# EasyEDA schematic SCH_ENAK-display_2025-10-05.json
TITLE: Display/bargraph module; REV: 1.0; Date: 2025-07-05; Sheet: 1/1; Drawn By: Jakub Pelc; Company: swpelc.eu
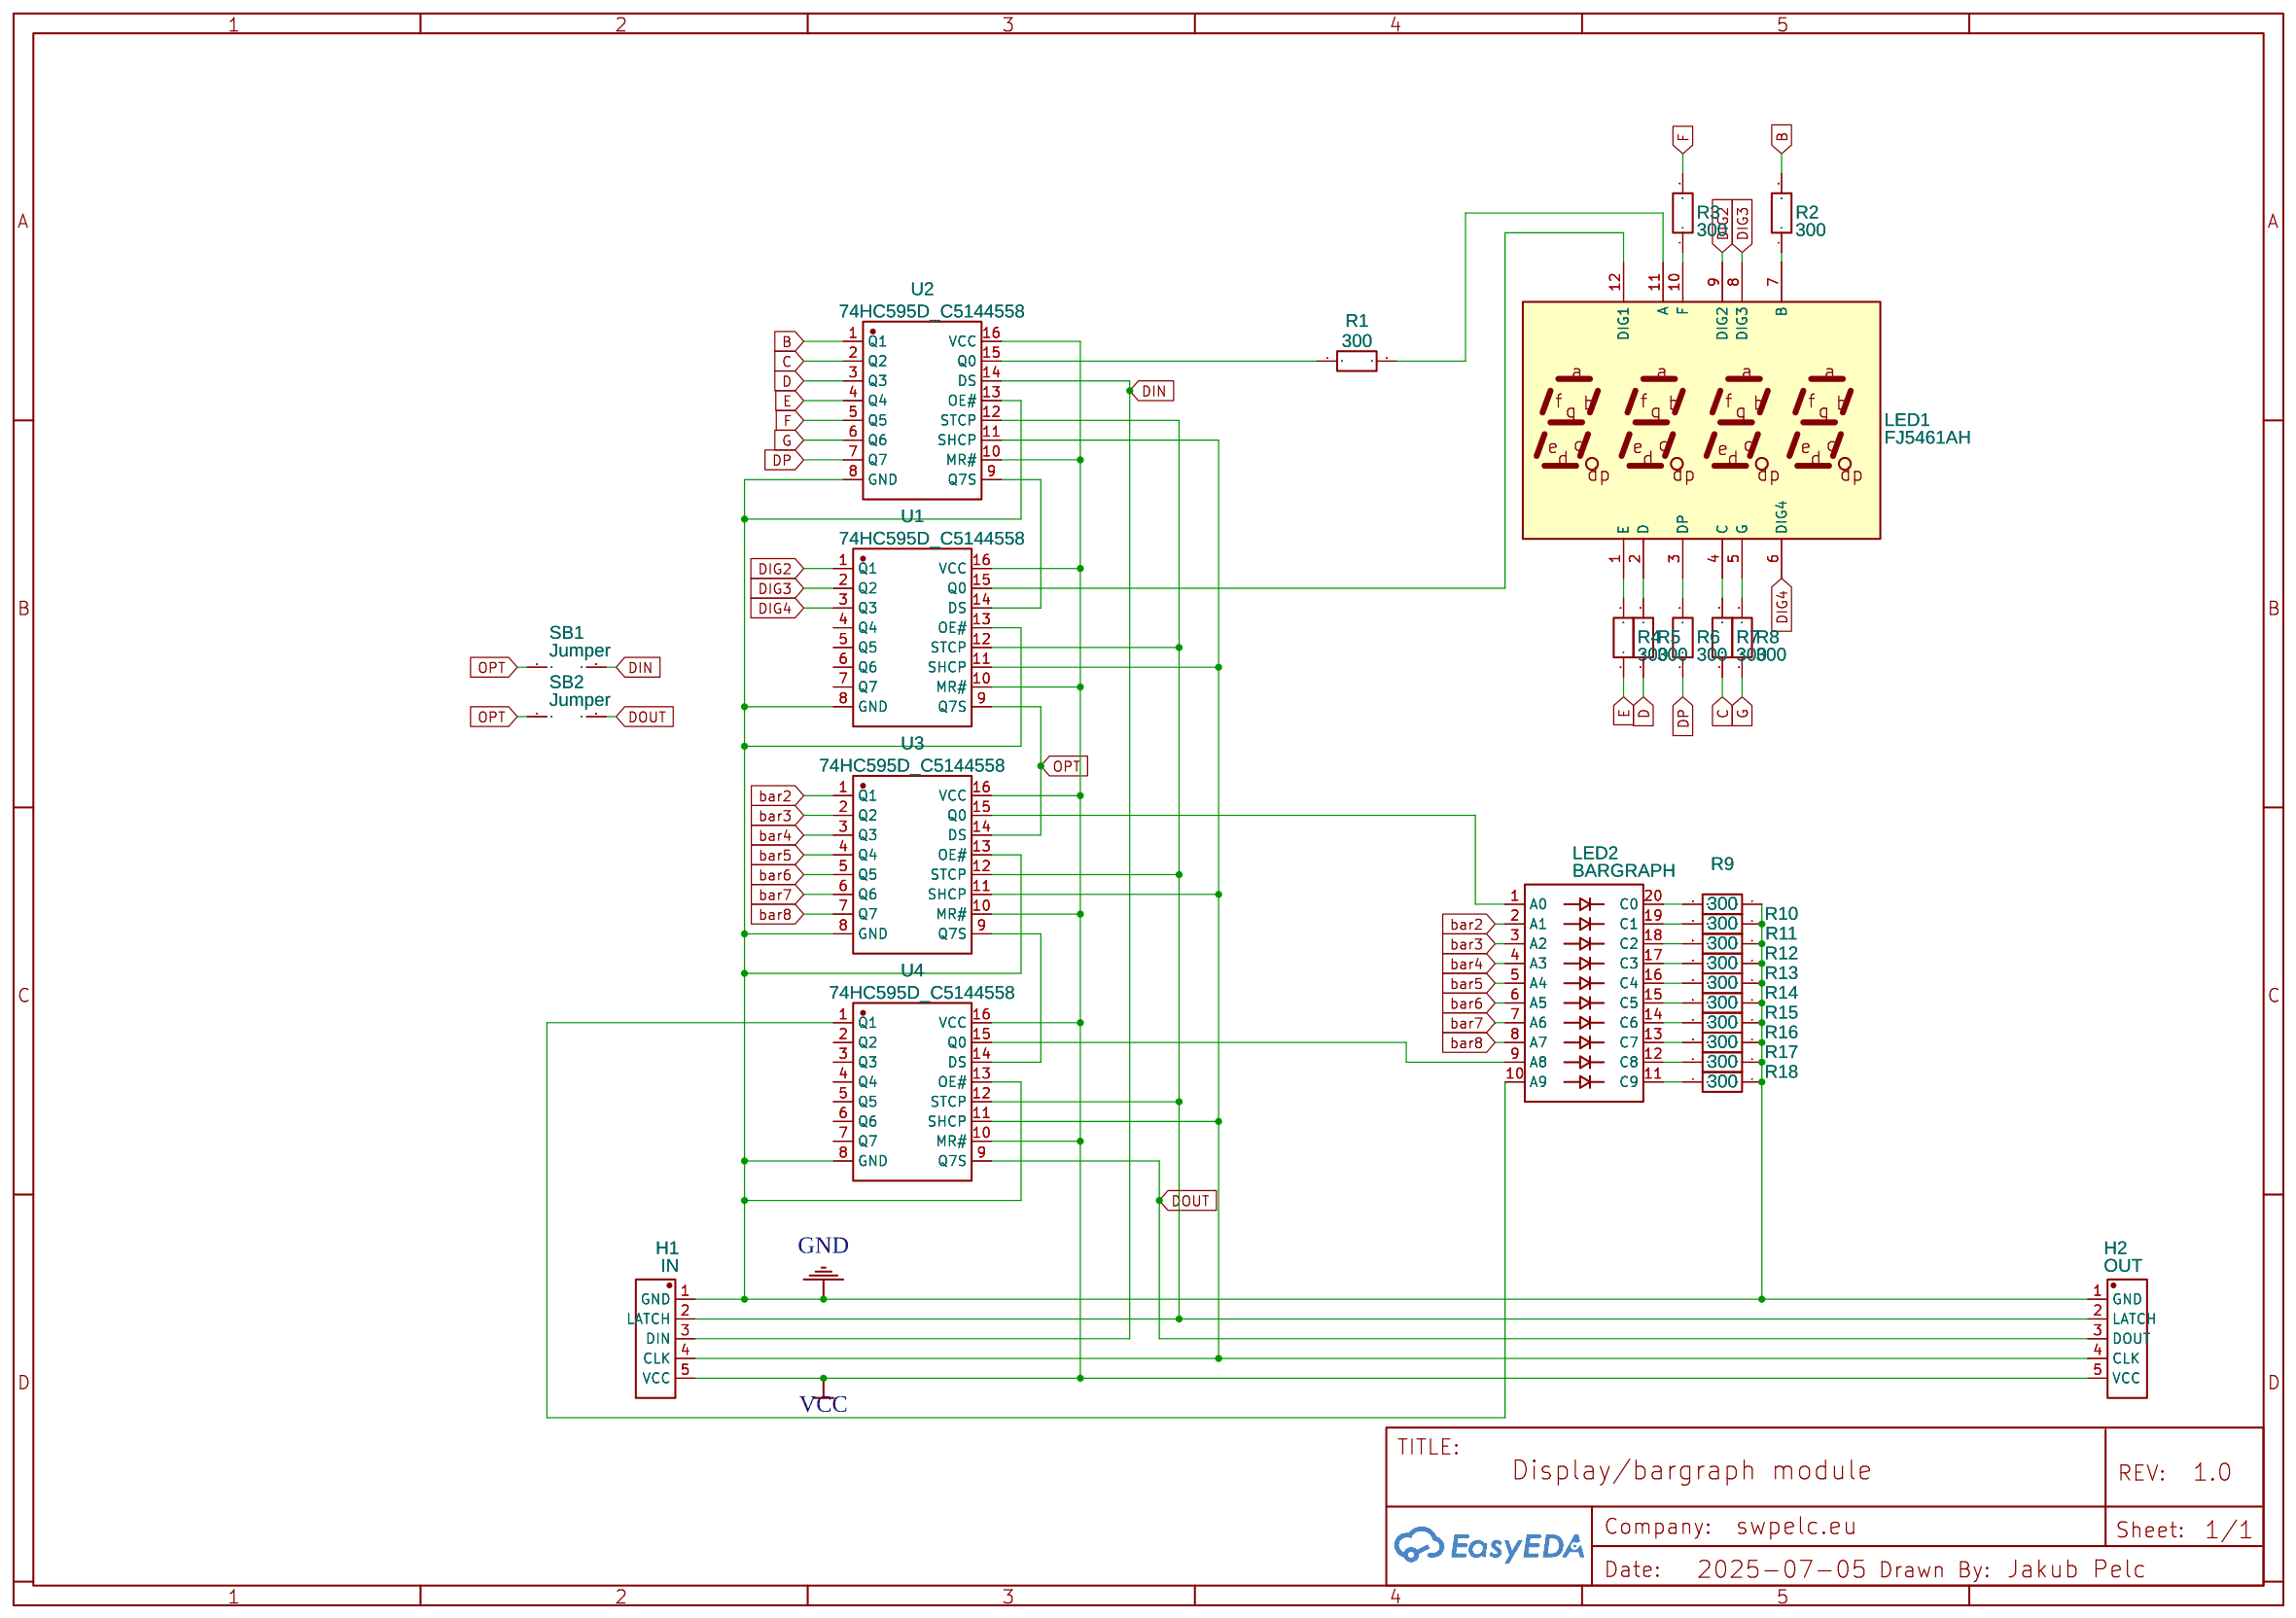
[diagram p0: schematic sheet]

## Parts
H1  IN  [HEADER-HEADER-FEMALE-2.54_1X5]
H2  OUT  [HEADER-HEADER-FEMALE-2.54_1X5]
LED1  FJ5461AH  [LED-SEG-TH_12P-L50.3-W19.0-P2.54-S15.24-BL]
LED2  BARGRAPH  [BARGRAPH]
R1  300  [R0603]
R2  300  [R0603]
R3  300  [R0603]
R4  300  [R0603]
R5  300  [R0603]
R6  300  [R0603]
R7  300  [R0603]
R8  300  [R0603]
R9  300  [R0603]
R10  300  [R0603]
R11  300  [R0603]
R12  300  [R0603]
R13  300  [R0603]
R14  300  [R0603]
R15  300  [R0603]
R16  300  [R0603]
R17  300  [R0603]
R18  300  [R0603]
SB1  Jumper  [PAD-JUMPER-2-OPEN-0603]
SB2  Jumper  [PAD-JUMPER-2-OPEN-0603]
U1  74HC595D_C5144558  [SOIC-16_L9.9-W3.9-P1.27-LS6.0-BL]
U2  74HC595D_C5144558  [SOIC-16_L9.9-W3.9-P1.27-LS6.0-BL]
U3  74HC595D_C5144558  [SOIC-16_L9.9-W3.9-P1.27-LS6.0-BL]
U4  74HC595D_C5144558  [SOIC-16_L9.9-W3.9-P1.27-LS6.0-BL]

## Library data of the parts
H1 H2 = HEADER - 2.54_1X5: Contributor: sohail.hdesign
LED1 = FJ5461AH: Supplier: LCSC; Manufacturer: 志浩; Manufacturer Part: FJ5461AH 橙红; Supplier Part: C10709; JLCPCB Part Class: Extended Part
LED2 = BARGRAPH: Contributor: mantex
R1-R18 = R_0603_EU: Supplier Part: C2907148; Supplier: LCSC; Contributor: LCEDA_Lib
SB1 SB2 = SMD JUMPER OPEN 2 PIN: Supplier: LCSC; Supplier Part: C21189; Manufacturer: NONE; Manufacturer Part: 0603WAF0000T5E; Contributor: Mirco Gaggiottini
U1-U4 = 74HC595D_C5144558: Supplier: LCSC; Supplier Part: C5144558; Manufacturer: JSMSEMI(杰盛微); Manufacturer Part: 74HC595D; JLCPCB Part Class: Extended Part; Contributor: lcsc

## Nets
GND: H1.1(GND) H2.1(GND) R9.1 R10.1 R11.1 R12.1 R13.1 R14.1 R15.1 R16.1 R17.1 R18.1 U1.8(GND) U1.13(OE#) U2.8(GND) U2.13(OE#) U3.8(GND) U3.13(OE#) U4.8(GND) U4.13(OE#)
VCC: H1.5(VCC) H2.5(VCC) U1.10(MR#) U1.16(VCC) U2.10(MR#) U2.16(VCC) U3.10(MR#) U3.16(VCC) U4.10(MR#) U4.16(VCC)
B: R2.2 U2.1(Q1)
bar2: LED2.2(A1) U3.1(Q1)
bar3: LED2.3(A2) U3.2(Q2)
bar4: LED2.4(A3) U3.3(Q3)
bar5: LED2.5(A4) U3.4(Q4)
bar6: LED2.6(A5) U3.5(Q5)
bar7: LED2.7(A6) U3.6(Q6)
bar8: LED2.8(A7) U3.7(Q7)
C: R7.1 U2.2(Q2)
D: R5.1 U2.3(Q3)
DIG2: LED1.9(DIG2) U1.1(Q1)
DIG3: LED1.8(DIG3) U1.2(Q2)
DIG4: LED1.6(DIG4) U1.3(Q3)
DIN: H1.3(DIN) SB1.2(N) U2.14(DS)
DOUT: H2.3(DOUT) SB2.2(N) U4.9(Q7S)
DP: R6.1 U2.7(Q7)
E: R4.1 U2.4(Q4)
F: R3.2 U2.5(Q5)
G: R8.1 U2.6(Q6)
OPT: SB1.1(P) SB2.1(P) U1.9(Q7S) U3.14(DS)
Net-(H1-2): H1.2(LATCH) H2.2(LATCH) U1.12(STCP) U2.12(STCP) U3.12(STCP) U4.12(STCP)
Net-(H1-4): H1.4(CLK) H2.4(CLK) U1.11(SHCP) U2.11(SHCP) U3.11(SHCP) U4.11(SHCP)
Net-(LED1-1): LED1.1(E) R4.2
Net-(LED1-2): LED1.2(D) R5.2
Net-(LED1-3): LED1.3(DP) R6.2
Net-(LED1-4): LED1.4(C) R7.2
Net-(LED1-5): LED1.5(G) R8.2
Net-(LED1-7): LED1.7(B) R2.1
Net-(LED1-10): LED1.10(F) R3.1
Net-(LED1-11): LED1.11(A) R1.2
Net-(LED1-12): LED1.12(DIG1) U1.15(Q0)
Net-(LED2-1): LED2.1(A0) U3.15(Q0)
Net-(LED2-9): LED2.9(A8) U4.15(Q0)
Net-(LED2-10): LED2.10(A9) U4.1(Q1)
Net-(LED2-11): LED2.11(C9) R18.2
Net-(LED2-12): LED2.12(C8) R17.2
Net-(LED2-13): LED2.13(C7) R16.2
Net-(LED2-14): LED2.14(C6) R15.2
Net-(LED2-15): LED2.15(C5) R14.2
Net-(LED2-16): LED2.16(C4) R13.2
Net-(LED2-17): LED2.17(C3) R12.2
Net-(LED2-18): LED2.18(C2) R11.2
Net-(LED2-19): LED2.19(C1) R10.2
Net-(LED2-20): LED2.20(C0) R9.2
Net-(R1-1): R1.1 U2.15(Q0)
Net-(U1-14): U1.14(DS) U2.9(Q7S)
Net-(U3-9): U3.9(Q7S) U4.14(DS)

Not connected (* = marked no-connect by the designer): U1 4(Q4) 5(Q5) 6(Q6) 7(Q7); U4 2(Q2) 3(Q3) 4(Q4) 5(Q5) 6(Q6) 7(Q7)
